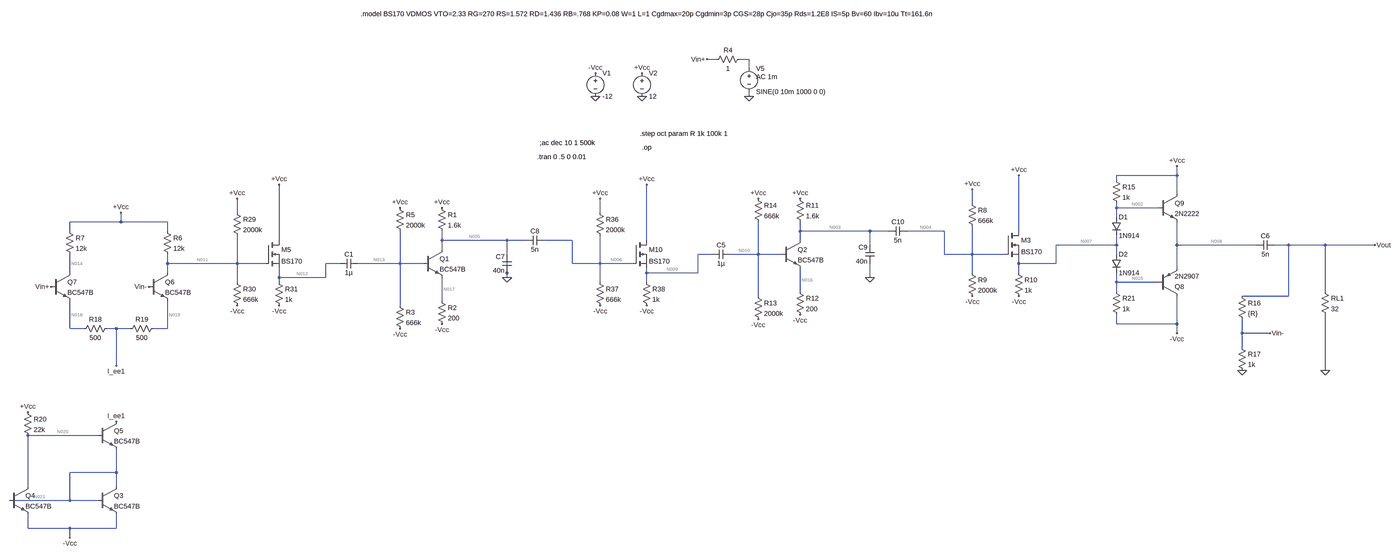
[diagram p0: schematic pushed yay.asc, whole sheet]
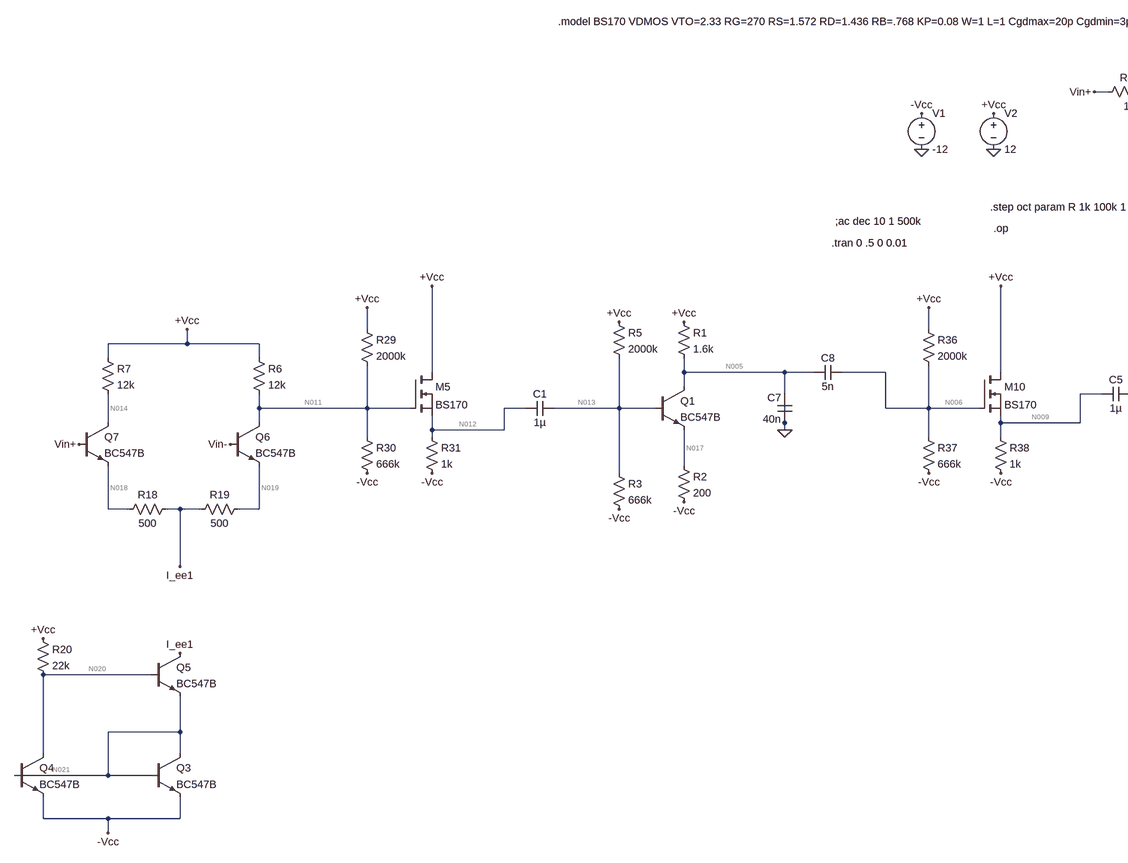
[diagram p1: schematic pushed yay.asc, part, row 1 of 1, column 1 of 2]
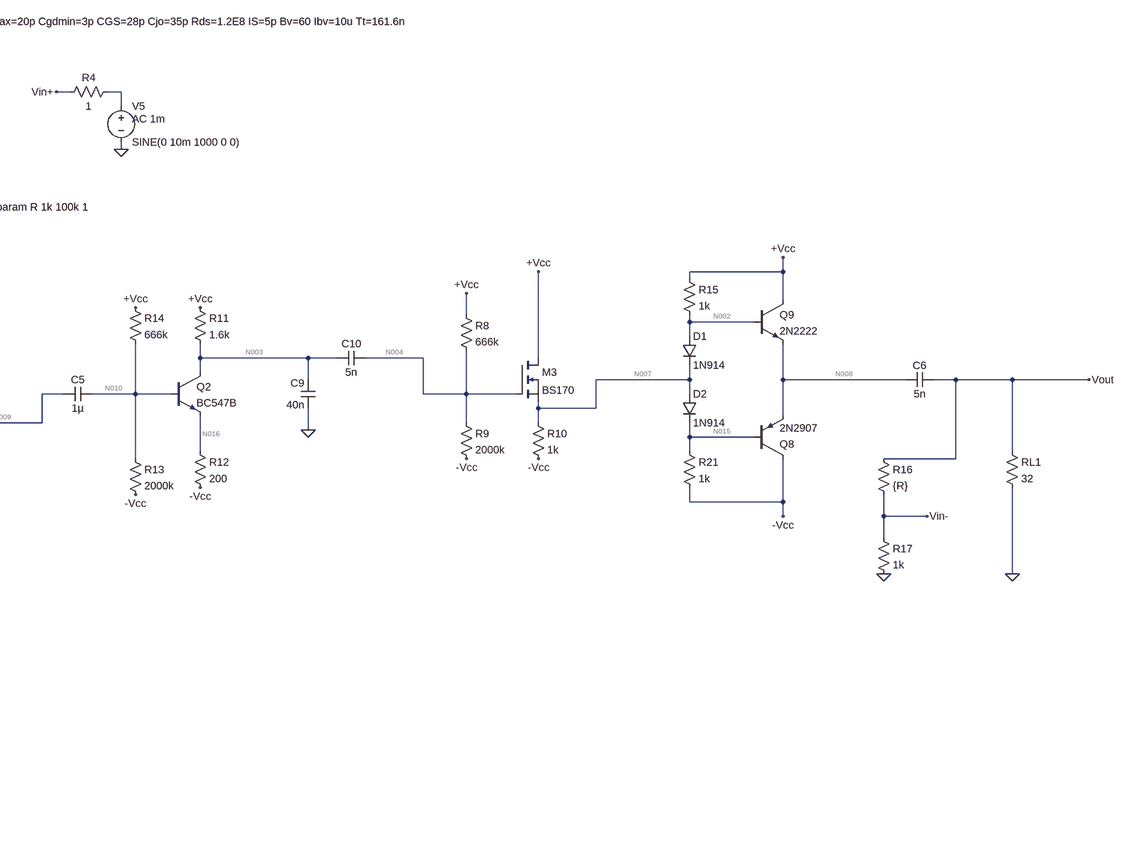
[diagram p2: schematic pushed yay.asc, part, row 1 of 1, column 2 of 2]
pushed yay.asc, the LTspice schematic file:
Version 4
SHEET 1 4264 732
WIRE -400 -1888 -432 -1888
WIRE -288 -1888 -320 -1888
WIRE -288 -1856 -288 -1888
WIRE -288 -1760 -288 -1776
WIRE 1184 -1488 1184 -1520
WIRE 1184 -1488 976 -1488
WIRE 976 -1472 976 -1488
WIRE 1184 -1424 1184 -1488
WIRE 480 -1392 480 -1440
WIRE 976 -1376 976 -1392
WIRE 1120 -1376 976 -1376
WIRE -2048 -1360 -2048 -1408
WIRE -800 -1360 -800 -1408
WIRE 976 -1344 976 -1376
WIRE -2448 -1328 -2448 -1360
WIRE -2448 -1328 -2624 -1328
WIRE -2288 -1328 -2448 -1328
WIRE -2624 -1296 -2624 -1328
WIRE -2288 -1296 -2288 -1328
WIRE -112 -1296 -112 -1328
WIRE 128 -1296 -112 -1296
WIRE 192 -1296 128 -1296
WIRE 384 -1296 256 -1296
WIRE 640 -1296 640 -1488
WIRE -1904 -1264 -1904 -1456
WIRE -1344 -1264 -1344 -1296
WIRE -1120 -1264 -1344 -1264
WIRE -1056 -1264 -1120 -1264
WIRE -896 -1264 -992 -1264
WIRE -640 -1264 -640 -1456
WIRE -112 -1264 -112 -1296
WIRE 128 -1248 128 -1296
WIRE 976 -1248 976 -1280
WIRE 976 -1248 768 -1248
WIRE 1184 -1248 1184 -1328
WIRE 1456 -1248 1184 -1248
WIRE 1568 -1248 1520 -1248
WIRE 1792 -1248 1568 -1248
WIRE 2016 -1248 1792 -1248
WIRE -1344 -1232 -1344 -1264
WIRE -1120 -1216 -1120 -1264
WIRE -416 -1216 -464 -1216
WIRE -256 -1216 -256 -1328
WIRE -256 -1216 -352 -1216
WIRE -176 -1216 -256 -1216
WIRE 384 -1216 384 -1296
WIRE 480 -1216 480 -1312
WIRE 480 -1216 384 -1216
WIRE 592 -1216 480 -1216
WIRE 976 -1216 976 -1248
WIRE -2288 -1184 -2288 -1216
WIRE -2048 -1184 -2048 -1280
WIRE -2048 -1184 -2288 -1184
WIRE -1952 -1184 -2048 -1184
WIRE -1696 -1184 -1744 -1184
WIRE -1488 -1184 -1488 -1296
WIRE -1488 -1184 -1632 -1184
WIRE -1408 -1184 -1488 -1184
WIRE -896 -1184 -896 -1264
WIRE -800 -1184 -800 -1280
WIRE -800 -1184 -896 -1184
WIRE -688 -1184 -800 -1184
WIRE 640 -1184 640 -1200
WIRE 768 -1184 768 -1248
WIRE 768 -1184 640 -1184
WIRE 1184 -1168 1184 -1248
WIRE -2624 -1152 -2624 -1216
WIRE -2288 -1152 -2288 -1184
WIRE -1120 -1152 -1120 -1200
WIRE -640 -1152 -640 -1168
WIRE -464 -1152 -464 -1216
WIRE -464 -1152 -640 -1152
WIRE 480 -1152 480 -1216
WIRE 640 -1152 640 -1184
WIRE -1904 -1136 -1904 -1168
WIRE -1744 -1136 -1744 -1184
WIRE -1744 -1136 -1904 -1136
WIRE -1120 -1136 -1120 -1152
WIRE 128 -1136 128 -1184
WIRE -2048 -1120 -2048 -1184
WIRE -1904 -1120 -1904 -1136
WIRE -800 -1120 -800 -1184
WIRE -640 -1120 -640 -1152
WIRE 976 -1120 976 -1152
WIRE 1120 -1120 976 -1120
WIRE -112 -1088 -112 -1168
WIRE 976 -1088 976 -1120
WIRE 1792 -1088 1792 -1248
WIRE -256 -1072 -256 -1216
WIRE 1568 -1072 1568 -1248
WIRE 1568 -1072 1408 -1072
WIRE -1344 -1056 -1344 -1136
WIRE -1488 -1040 -1488 -1184
WIRE 976 -976 976 -1008
WIRE 1184 -976 1184 -1072
WIRE 1184 -976 976 -976
WIRE -2624 -960 -2624 -1056
WIRE -2576 -960 -2624 -960
WIRE -2464 -960 -2496 -960
WIRE -2416 -960 -2464 -960
WIRE -2288 -960 -2288 -1056
WIRE -2288 -960 -2336 -960
WIRE 1184 -944 1184 -976
WIRE 1408 -944 1408 -992
WIRE 1504 -944 1408 -944
WIRE 1408 -896 1408 -944
WIRE -2464 -832 -2464 -960
WIRE 1792 -816 1792 -1008
WIRE -2528 -592 -2768 -592
WIRE -2464 -464 -2464 -544
WIRE -2464 -464 -2624 -464
WIRE -2768 -416 -2768 -592
WIRE -2464 -416 -2464 -464
WIRE -2624 -368 -2624 -464
WIRE -2624 -368 -2832 -368
WIRE -2528 -368 -2624 -368
WIRE -2768 -272 -2768 -320
WIRE -2624 -272 -2768 -272
WIRE -2464 -272 -2464 -320
WIRE -2464 -272 -2624 -272
WIRE -2624 -240 -2624 -272
FLAG -816 -1760 0
FLAG -656 -1760 0
FLAG -816 -1840 -Vcc
FLAG -656 -1840 +Vcc
FLAG -288 -1760 0
FLAG -432 -1888 Vin+
FLAG -800 -1408 +Vcc
FLAG -640 -1456 +Vcc
FLAG -1488 -1376 +Vcc
FLAG -1344 -1376 +Vcc
FLAG -2448 -1360 +Vcc
FLAG 480 -1440 +Vcc
FLAG 640 -1488 +Vcc
FLAG -256 -1408 +Vcc
FLAG -112 -1408 +Vcc
FLAG -2624 -240 -Vcc
FLAG -2768 -672 +Vcc
FLAG -2464 -640 I_ee1
FLAG -2464 -832 I_ee1
FLAG -1488 -960 -Vcc
FLAG -1344 -976 -Vcc
FLAG -800 -1040 -Vcc
FLAG -640 -1040 -Vcc
FLAG -256 -992 -Vcc
FLAG -112 -1008 -Vcc
FLAG 480 -1072 -Vcc
FLAG 640 -1072 -Vcc
FLAG 2016 -1248 Vout
FLAG 1504 -944 Vin-
FLAG 1408 -816 0
FLAG -2048 -1408 +Vcc
FLAG -1904 -1456 +Vcc
FLAG -2048 -1040 -Vcc
FLAG -1904 -1040 -Vcc
FLAG -1120 -1136 0
FLAG 128 -1136 0
FLAG -2688 -1104 Vin+
FLAG -2352 -1104 Vin-
FLAG 1792 -816 0
FLAG 1184 -944 -Vcc
FLAG 1184 -1520 +Vcc
SYMBOL voltage -816 -1856 R0
WINDOW 123 0 0 Left 0
WINDOW 39 0 0 Left 0
SYMATTR InstName V1
SYMATTR Value -12
SYMBOL voltage -656 -1856 R0
WINDOW 123 0 0 Left 0
WINDOW 39 0 0 Left 0
SYMATTR InstName V2
SYMATTR Value 12
SYMBOL voltage -288 -1872 R0
WINDOW 123 24 44 Left 2
WINDOW 39 0 0 Left 0
SYMATTR Value2 AC 1m
SYMATTR InstName V5
SYMATTR Value SINE(0 10m 1000 0 0)
SYMBOL res -304 -1904 R90
WINDOW 0 0 56 VBottom 2
WINDOW 3 32 56 VTop 2
SYMATTR InstName R4
SYMATTR Value 1
SYMBOL nmos -688 -1264 R0
SYMATTR InstName M10
SYMATTR Value BS170
SYMBOL res -816 -1376 R0
SYMATTR InstName R36
SYMATTR Value 2000k
SYMBOL res -816 -1136 R0
SYMATTR InstName R37
SYMATTR Value 666k
SYMBOL res -656 -1136 R0
SYMATTR InstName R38
SYMATTR Value 1k
SYMBOL npn -1408 -1232 R0
SYMATTR InstName Q1
SYMATTR Value BC547B
SYMBOL res -1360 -1392 R0
SYMATTR InstName R1
SYMATTR Value 1.6k
SYMBOL res -1360 -1072 R0
SYMATTR InstName R2
SYMATTR Value 200
SYMBOL res -1504 -1056 R0
SYMATTR InstName R3
SYMATTR Value 666k
SYMBOL res -1504 -1392 R0
SYMATTR InstName R5
SYMATTR Value 2000k
SYMBOL res -2304 -1312 R0
SYMATTR InstName R6
SYMATTR Value 12k
SYMBOL res -2640 -1312 R0
SYMATTR InstName R7
SYMATTR Value 12k
SYMBOL nmos 592 -1296 R0
SYMATTR InstName M3
SYMATTR Value BS170
SYMBOL res 464 -1408 R0
SYMATTR InstName R8
SYMATTR Value 666k
SYMBOL res 464 -1168 R0
SYMATTR InstName R9
SYMATTR Value 2000k
SYMBOL res 624 -1168 R0
SYMATTR InstName R10
SYMATTR Value 1k
SYMBOL npn -176 -1264 R0
SYMATTR InstName Q2
SYMATTR Value BC547B
SYMBOL res -128 -1424 R0
SYMATTR InstName R11
SYMATTR Value 1.6k
SYMBOL res -128 -1104 R0
SYMATTR InstName R12
SYMATTR Value 200
SYMBOL res -272 -1088 R0
SYMATTR InstName R13
SYMATTR Value 2000k
SYMBOL res -272 -1424 R0
SYMATTR InstName R14
SYMATTR Value 666k
SYMBOL res -2480 -976 R90
WINDOW 0 0 56 VBottom 2
WINDOW 3 32 56 VTop 2
SYMATTR InstName R18
SYMATTR Value 500
SYMBOL res -2320 -976 R90
WINDOW 0 0 56 VBottom 2
WINDOW 3 32 56 VTop 2
SYMATTR InstName R19
SYMATTR Value 500
SYMBOL npn -2528 -416 R0
SYMATTR InstName Q3
SYMATTR Value BC547B
SYMBOL npn -2832 -416 R0
SYMATTR InstName Q4
SYMATTR Value BC547B
SYMBOL npn -2528 -640 R0
SYMATTR InstName Q5
SYMATTR Value BC547B
SYMBOL res -2784 -688 R0
SYMATTR InstName R20
SYMATTR Value 22k
SYMBOL cap -352 -1232 R90
WINDOW 0 0 32 VBottom 2
WINDOW 3 32 32 VTop 2
SYMATTR InstName C5
SYMATTR Value 1µ
SYMBOL cap -1632 -1200 R90
WINDOW 0 0 32 VBottom 2
WINDOW 3 32 32 VTop 2
SYMATTR InstName C1
SYMATTR Value 1µ
SYMBOL cap 1520 -1264 R90
WINDOW 0 0 32 VBottom 2
WINDOW 3 32 32 VTop 2
SYMATTR InstName C6
SYMATTR Value 5n
SYMBOL res 1392 -1088 R0
SYMATTR InstName R16
SYMATTR Value {R}
SYMBOL res 1392 -912 R0
SYMATTR InstName R17
SYMATTR Value 1k
SYMBOL nmos -1952 -1264 R0
SYMATTR InstName M5
SYMATTR Value BS170
SYMBOL res -2064 -1376 R0
SYMATTR InstName R29
SYMATTR Value 2000k
SYMBOL res -2064 -1136 R0
SYMATTR InstName R30
SYMATTR Value 666k
SYMBOL res -1920 -1136 R0
SYMATTR InstName R31
SYMATTR Value 1k
SYMBOL cap -1104 -1152 R180
WINDOW 0 24 56 Left 2
WINDOW 3 24 8 Left 2
SYMATTR InstName C7
SYMATTR Value 40n
SYMBOL cap -992 -1280 R90
WINDOW 0 0 32 VBottom 2
WINDOW 3 32 32 VTop 2
SYMATTR InstName C8
SYMATTR Value 5n
SYMBOL cap 144 -1184 R180
WINDOW 0 24 56 Left 2
WINDOW 3 24 8 Left 2
SYMATTR InstName C9
SYMATTR Value 40n
SYMBOL cap 256 -1312 R90
WINDOW 0 0 32 VBottom 2
WINDOW 3 32 32 VTop 2
SYMATTR InstName C10
SYMATTR Value 5n
SYMBOL npn -2688 -1152 R0
SYMATTR InstName Q7
SYMATTR Value BC547B
SYMBOL npn -2352 -1152 R0
SYMATTR InstName Q6
SYMATTR Value BC547B
SYMBOL pnp 1120 -1072 M180
SYMATTR InstName Q8
SYMATTR Value 2N2907
SYMBOL npn 1120 -1424 R0
SYMATTR InstName Q9
SYMATTR Value 2N2222
SYMBOL res 1776 -1104 R0
SYMATTR InstName RL1
SYMATTR Value 32
SYMBOL res 960 -1488 R0
SYMATTR InstName R15
SYMATTR Value 1k
SYMBOL res 960 -1104 R0
SYMATTR InstName R21
SYMATTR Value 1k
SYMBOL diode 960 -1344 R0
SYMATTR InstName D1
SYMATTR Value 1N914
SYMBOL diode 960 -1216 R0
SYMATTR InstName D2
SYMATTR Value 1N914
TEXT -1016 -1552 Left 2 !.tran 0 .5 0 0.01
TEXT -1624 -2048 Left 2 !.model BS170 VDMOS VTO=2.33 RG=270 RS=1.572 RD=1.436 RB=.768 KP=0.08 W=1 L=1 Cgdmax=20p Cgdmin=3p CGS=28p Cjo=35p Rds=1.2E8 IS=5p Bv=60 Ibv=10u Tt=161.6n
TEXT -1008 -1600 Left 2 !;ac dec 10 1 500k
TEXT -664 -1632 Left 2 !.step oct param R 1k 100k 1
TEXT -656 -1584 Left 2 !.op

The netlist it stands for:
* pushed yay.asc
V1 -Vcc 0 -12
V2 +Vcc 0 12
V5 N001 0 SINE(0 10m 1000 0 0) AC 1m
R4 N001 Vin+ 1
M10 +Vcc N006 N009 N009 BS170
R36 +Vcc N006 2000k
R37 N006 -Vcc 666k
R38 N009 -Vcc 1k
Q1 N005 N013 N017 0 BC547B
R1 +Vcc N005 1.6k
R2 N017 -Vcc 200
R3 N013 -Vcc 666k
R5 +Vcc N013 2000k
R6 +Vcc N011 12k
R7 +Vcc N014 12k
M3 +Vcc N004 N007 N007 BS170
R8 +Vcc N004 666k
R9 N004 -Vcc 2000k
R10 N007 -Vcc 1k
Q2 N003 N010 N016 0 BC547B
R11 +Vcc N003 1.6k
R12 N016 -Vcc 200
R13 N010 -Vcc 2000k
R14 +Vcc N010 666k
R18 I_ee1 N018 500
R19 N019 I_ee1 500
Q3 N021 N021 -Vcc 0 BC547B
Q4 N020 N021 -Vcc 0 BC547B
Q5 I_ee1 N020 N021 0 BC547B
R20 +Vcc N020 22k
C5 N010 N009 1µ
C1 N013 N012 1µ
C6 Vout N008 5n
R16 Vout Vin- {R}
R17 Vin- 0 1k
M5 +Vcc N011 N012 N012 BS170
R29 +Vcc N011 2000k
R30 N011 -Vcc 666k
R31 N012 -Vcc 1k
C7 0 N005 40n
C8 N006 N005 5n
C9 0 N003 40n
C10 N004 N003 5n
Q7 N014 Vin+ N018 0 BC547B
Q6 N011 Vin- N019 0 BC547B
Q8 -Vcc N015 N008 0 2N2907
Q9 +Vcc N002 N008 0 2N2222
RL1 Vout 0 32
R15 +Vcc N002 1k
R21 N015 -Vcc 1k
D1 N002 N007 1N914
D2 N007 N015 1N914
.model D D
.lib standard.dio
.model NPN NPN
.model PNP PNP
.lib standard.bjt
.model NMOS NMOS
.model PMOS PMOS
.lib standard.mos
.tran 0 .5 0 0.01
.model BS170 VDMOS VTO=2.33 RG=270 RS=1.572 RD=1.436 RB=.768 KP=0.08 W=1 L=1 Cgdmax=20p Cgdmin=3p CGS=28p Cjo=35p Rds=1.2E8 IS=5p Bv=60 Ibv=10u Tt=161.6n
;ac dec 10 1 500k
.step oct param R 1k 100k 1
.op
.backanno
.end

* Results of the author's LTspice run, read from the files saved beside the schematic
* Operating Point (first step), zero values left out:
*   r = 1 k
*   V(-vcc) = -12 V
*   V(+vcc) = 12 V
*   V(vin+) = -1.649 µV
*   V(n006) = -6.005 V
*   V(n009) = -8.63 V
*   V(n005) = 6.657 V
*   V(n013) = -10.66 V
*   V(n017) = -11.33 V
*   V(n011) = 5.609 V
*   V(n014) = 5.868 V
*   V(n004) = 6.005 V
*   V(n007) = 2.922 V
*   V(n003) = -2.731 V
*   V(n010) = -9.453 V
*   V(n016) = -10.15 V
*   V(i_ee1) = -875.1 mV
*   V(n018) = -618.7 mV
*   V(n019) = -619.6 mV
*   V(n021) = -11.36 V
*   V(n020) = -10.72 V
*   V(n012) = 2.651 V
*   V(vout) = -25.99 µV
*   V(n008) = 2.908 V
*   V(vin-) = -838.1 µV
*   V(n015) = 2.209 V
*   V(n002) = 3.607 V
*   Ic(Q9) = 5.562 mA
*   Ib(Q9) = 26.1 µA
*   Ie(Q9) = -5.588 mA
*   Ic(Q8) = -5.568 mA
*   Ib(Q8) = -20.24 µA
*   Ie(Q8) = 5.588 mA
*   Ic(Q6) = 509.3 µA
*   Ib(Q6) = 1.65 µA
*   Ie(Q6) = -510.9 µA
*   Ic(Q7) = 511 µA
*   Ib(Q7) = 1.649 µA
*   Ie(Q7) = -512.6 µA
*   Ic(Q5) = 1.024 mA
*   Ib(Q5) = 3.124 µA
*   Ie(Q5) = -1.027 mA
*   Ic(Q4) = 1.03 mA
*   Ib(Q4) = 3.611 µA
*   Ie(Q4) = -1.033 mA
*   Ic(Q3) = 1.019 mA
*   Ib(Q3) = 3.612 µA
*   Ie(Q3) = -1.023 mA
*   Ic(Q2) = 9.207 mA
*   Ib(Q2) = 30.94 µA
*   Ie(Q2) = -9.238 mA
*   Ic(Q1) = 3.339 mA
*   Ib(Q1) = 9.328 µA
*   Ie(Q1) = -3.348 mA
*   Id(M5) = 14.65 mA
*   Is(M5) = -14.65 mA
*   Id(M3) = 20.74 mA
*   Is(M3) = -20.74 mA
*   Id(M10) = 3.37 mA
*   Is(M10) = -3.37 mA
*   I(D2) = 14.19 mA
*   I(D1) = 8.367 mA
*   I(R21) = 14.21 mA
*   I(R15) = 8.393 mA
*   I(Rl1) = -812.1 nA
*   I(R31) = 14.65 mA
*   I(R30) = 26.44 µA
*   I(R29) = 3.195 µA
*   I(R17) = -838.1 nA
*   I(R16) = 812.1 nA
*   I(R20) = 1.033 mA
*   I(R19) = 510.9 µA
*   I(R18) = -512.6 µA
*   I(R14) = 32.21 µA
*   I(R13) = 1.274 µA
*   I(R12) = 9.238 mA
*   I(R11) = 9.207 mA
*   I(R10) = 14.92 mA
*   I(R9) = 9.002 µA
*   I(R8) = 9.002 µA
*   I(R7) = 511 µA
*   I(R6) = 532.5 µA
*   I(R5) = 11.33 µA
*   I(R3) = 2.005 µA
*   I(R2) = 3.348 mA
*   I(R1) = 3.339 mA
*   I(R38) = 3.37 mA
*   I(R37) = 9.002 µA
*   I(R36) = 9.002 µA
*   I(R4) = 1.649 µA
*   I(V5) = -1.649 µA
*   I(V2) = -67.41 mA
*   I(V1) = 67.41 mA